# EAGLE design Rauchmelder 3.0 (EAGLE 7.4.0)
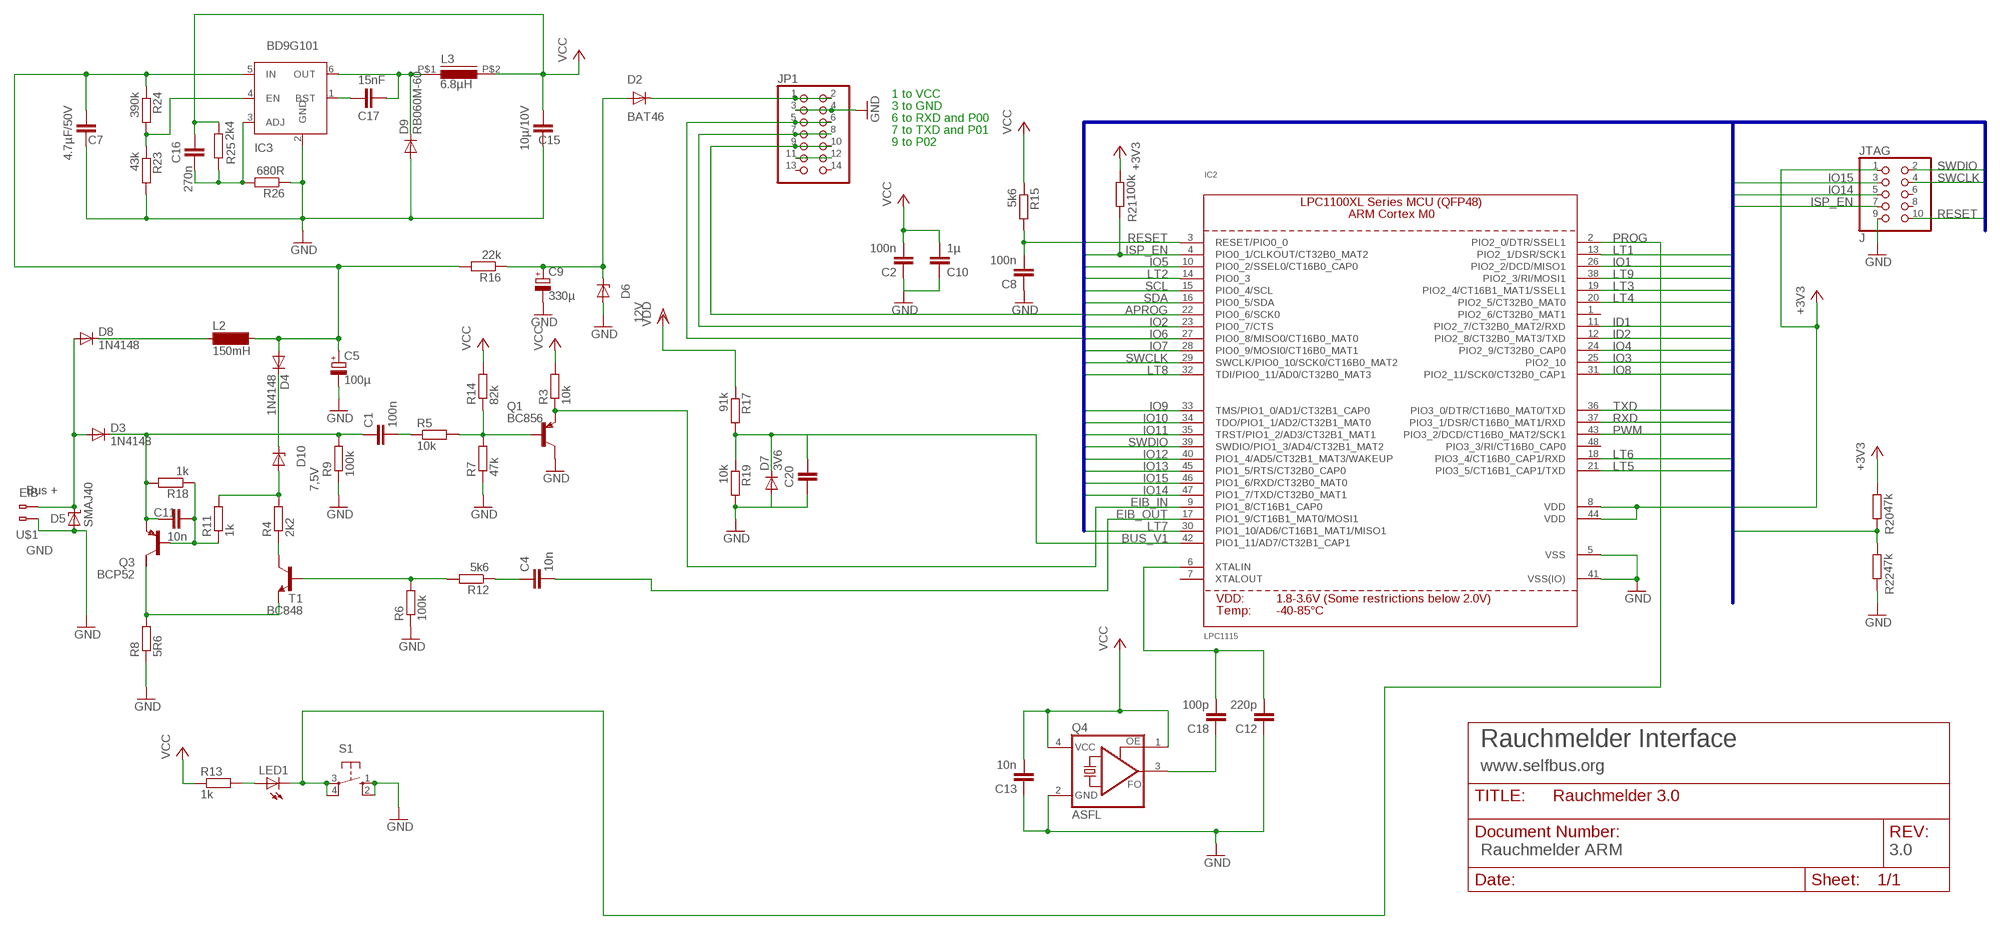
[diagram p0: schematic, sheet 1]

## Parts
C1  100n  C-EUC1206  [C1206]
C2  100n  C-EUC1206  [C1206]
C4  10n  C-EUC1206  [C1206]
C5  100µ  CPOL-EUSANYO_SMD_C6  [SANYO-OSCON_SMD_C6]
C7  4.7µF/50V  C-EUC1206K  [C1206K]
C8  100n  C-EUC1206  [C1206]
C9  330µ  CPOL-EUE3.5-8  [E3,5-8]
C10  1µ  C-EUC1206  [C1206]
C11  10n  C-EUC1206  [C1206]
C12  220p  C-EUC1206  [C1206]
C13  10n  C-EUC1206  [C1206]
C15  10µ/10V  C-EUC1206K  [C1206K]
C16  270n  C-EUC1206  [C1206]
C17  15nF  C-EUC1206  [C1206]
C18  100p  C-EUC1206  [C1206]
C20  C-EUC1206  [C1206]
D2  BAT46  DIODE-MINIMELF  [MINIMELF]
D3  1N4148  DIODE-MINIMELF  [MINIMELF]
D4  1N4148  DIODE-MINIMELF  [MINIMELF]
D5  SMAJ40  SUPPRESSOR-SMBJ  [SMBJ]
D6  12V  ZPD  [MINIMELF]
D7  3V6  DIODE-MINIMELF  [MINIMELF]
D8  1N4148  DIODE-MINIMELF  [MINIMELF]
D9  RB060M-60  DIODE-SOD123  [SOD123]
D10  7,5V  ZPD  [MINIMELF]
IC2  LPC1115  LPC1113/4/5_QFP48_XLSERIES  [LQFP48]
IC3  BD9G101  BD9G101GBD9G101G-SOT23-6  [SOT23-6]
JP1  PINHD-2X7  [2X07]
JTAG  J  PINHD-2X05_2.00  [2X05M]
L2  150mH  BS11  [BS11]
L3  6.8µH  IND_FASTRON_1616FPS  [PIS2812]
LED1  LED3MM  [LED3MM]
Q1  BC856  BC856ALT1SMD  [SOT23-BEC]
Q3  BCP52  FZT753SMD  [SOT223]
Q4  ASFL  [ASF]
R3  10k  R-EU_R1206  [R1206]
R4  2k2  R-EU_R1206  [R1206]
R5  10k  R-EU_R1206  [R1206]
R6  100k  R-EU_R1206  [R1206]
R7  47k  R-EU_R1206  [R1206]
R8  5R6  R-EU_R1206  [R1206]
R9  100k  R-EU_R1206  [R1206]
R11  1k  R-EU_R1206  [R1206]
R12  5k6  R-EU_R1206  [R1206]
R13  1k  R-EU_R1206  [R1206]
R14  82k  R-EU_R1206  [R1206]
R15  5k6  R-EU_R1206  [R1206]
R16  22k  R-EU_R1206  [R1206]
R17  91k  R-EU_R1206  [R1206]
R18  1k  R-EU_R1206  [R1206]
R19  10k  R-EU_R1206  [R1206]
R20  47k  R-EU_R1206  [R1206]
R21  100k  R-EU_R1206  [R1206]
R22  47k  R-EU_R1206  [R1206]
R23  43k  R-EU_R1206  [R1206]
R24  390k  R-EU_R1206  [R1206]
R25  2k4  R-EU_R1206  [R1206]
R26  680R  R-EU_R1206  [R1206]
S1  10-XX  [B3F-10XX]
T1  BC848  [SOT23]
U$1  EIB  [BUSKLEMME243-724]

## Nets
ADJ: C16.1 IC3.3(ADJ) R25.1 R26.2
APROG: IC2.22(PIO0_6/SCK0)
BUS_V1: C20.2 D7.C IC2.42(PIO1_11/AD7/CT32B1_CAP1) R17.2 R19.1
EIB+: D3.A D5.C D8.A U$1.2(B-2)
EIB_DC: C5.+ C7.2 D4.A IC3.5(IN) L2.2 R16.2 R17.1 R24.1 ; supply symbol labelled VDD
EIB_IN: IC2.9(PIO1_8/CT16B1_CAP0) Q1.E R3.1
EIB_OUT: C4.2 IC2.17(PIO1_9/CT16B1_MAT0/MOSI1)
ENABLE_SW: IC3.4(EN) R23.1 R24.2
GND: C2.1 C5.- C7.1 C8.1 C9.- C10.1 C12.1 C13.1 C15.1 C20.1 D5.A D6.A D7.A D9.A IC2.5(VSS) IC2.41(VSS(IO)) IC3.2(GND) JP1.3 JP1.4 JTAG.9 Q1.C Q4.2(GND) R6.1 R7.1 R8.1 R9.1 R19.2 R22.1 R23.2 R26.1 S1.1(S) S1.2(S1) U$1.1(B-1)
ID1: IC2.11(PIO2_7/CT32B0_MAT2/RXD)
ID2: IC2.12(PIO2_8/CT32B0_MAT3/TXD)
IO1: IC2.26(PIO2_2/DCD/MISO1)
IO2: IC2.23(PIO0_7/CTS)
IO3: IC2.25(PIO2_10)
IO4: IC2.24(PIO2_9/CT32B0_CAP0)
IO5: IC2.10(PIO0_2/SSEL0/CT16B0_CAP0)
IO6: IC2.27(PIO0_8/MISO0/CT16B0_MAT0)
IO7: IC2.28(PIO0_9/MOSI0/CT16B0_MAT1)
IO8: IC2.31(PIO2_11/SCK0/CT32B0_CAP1)
IO9: IC2.33(TMS/PIO1_0/AD1/CT32B1_CAP0)
IO10: IC2.34(TDO/PIO1_1/AD2/CT32B1_MAT0)
IO11: IC2.35(TRST/PIO1_2/AD3/CT32B1_MAT1)
IO12: IC2.40(PIO1_4/AD5/CT32B1_MAT3/WAKEUP) R20.1 R22.2
IO13: IC2.45(PIO1_5/RTS/CT32B0_CAP0)
IO14: IC2.47(PIO1_7/TXD/CT32B0_MAT1) JTAG.5
IO15: IC2.46(PIO1_6/RXD/CT32B0_MAT0) JTAG.3
ISP_EN: IC2.4(PIO0_1/CLKOUT/CT32B0_MAT2) JTAG.7 R21.1
LT1: IC2.13(PIO2_1/DSR/SCK1)
LT2: IC2.14(PIO0_3)
LT3: IC2.19(PIO2_4/CT16B1_MAT1/SSEL1)
LT4: IC2.20(PIO2_5/CT32B0_MAT0)
LT5: IC2.21(PIO3_5/CT16B1_CAP1/TXD) JP1.9 JP1.10
LT6: IC2.18(PIO3_4/CT16B0_CAP1/RXD)
LT7: IC2.30(PIO1_10/AD6/CT16B1_MAT1/MISO1)
LT8: IC2.32(TDI/PIO0_11/AD0/CT32B0_MAT3)
LT9: IC2.38(PIO2_3/RI/MOSI1)
LX: C17.1 D9.C IC3.6(OUT) L3.P$1
N$2: Q1.B R5.2 R7.2 R14.1
N$4: C11.2 Q3.1(B) R11.1 R18.1
N$9: LED1.A R13.2
N$10: C9.+ D2.A D6.C R16.1
N$13: D8.C L2.1
N$15: D4.C D10.C
N$16: C1.2 R5.1
N$18: D2.C JP1.1 JP1.2
N$19: C17.2 IC3.1(BST)
N$22: C4.1 R12.1
N$23: R4.1 T1.3(C)
N$24: JP1.11 JP1.12
N$25: D10.A R4.2 R11.2
N$26: Q3.2(C) R8.2 T1.2(E)
N$32: C12.2 C18.2 IC2.6(XTALIN)
N$33: C1.1 C11.1 D3.C Q3.3(E) R9.2 R18.2
N$34: R6.2 R12.2 T1.1(B)
N$35: C18.1 Q4.3(FO)
PROG: IC2.2(PIO2_0/DTR/SSEL1) LED1.K(C) S1.3(P) S1.4(P1)
PWM: IC2.43(PIO3_2/DCD/CT16B0_MAT2/SCK1)
RESET: C8.2 IC2.3(RESET/PIO0_0) JTAG.10 R15.2
RXD: IC2.37(PIO3_1/DSR/CT16B0_MAT1/RXD) JP1.5 JP1.6
SCL: IC2.15(PIO0_4/SCL)
SDA: IC2.16(PIO0_5/SDA)
SWCLK: IC2.29(SWCLK/PIO0_10/SCK0/CT16B0_MAT2) JTAG.4
SWDIO: IC2.39(SWDIO/PIO1_3/AD4/CT32B1_MAT2) JTAG.2
TXD: IC2.36(PIO3_0/DTR/CT16B0_MAT0/TXD) JP1.7 JP1.8
VCC: C2.2 C10.2 C13.2 C15.2 C16.2 IC2.8(VDD) IC2.44(VDD) JTAG.1 L3.P$2 Q4.1(OE) Q4.4(VCC) R3.2 R13.1 R14.2 R15.1 R20.2 R21.2 R25.2 ; supply symbol labelled +3V3
Unconnected: IC2.1(PIO2_6/CT32B0_MAT1) IC2.7(XTALOUT) IC2.48(PIO3_3/RI/CT16B0_CAP0) JP1.13 JP1.14 JTAG.6 JTAG.8 Q3.4(C/)

## Buses
IO[1..15],LT[1..9],SCL,SDA,PWM,APROG,RXD,TXD,RESET,SWCLK,SWDIO,ISP_EN,ID1,ID2

## Notes on the sheet
- 1 to VCC
- 3 to GND
- 6 to RXD and P00
- 7 to TXD and P01
- 9 to P02
- Bus +
- GND
- Rauchmelder Interface
- www.selfbus.org
- Rauchmelder ARM | 3.0

## Library data of the parts
C1 C2 C4 C7 C8 C10-C13 C15-C18 C20 = rcl:C-EU: CAPACITOR, European symbol
C5 C9 = rcl:CPOL-EU: POLARIZED CAPACITOR, European symbol
D2-D4 D7-D9 = diode:DIODE-: DIODE
D5 = diode:SUPPRESSOR-: Suppressor diode
D6 D10 = diode:ZPD: Z DIODE 500 mW
IC2 = microbuilder:LPC1113/4/5_QFP48_XLSERIES: LPC1113/4/5 ARM Cortex M0 MCU (50MHz) - XL Series (FBD48/3x3) LPC1115FBD48/303: Max Frequency: 50MHz Flash: 64kB SRAM: 8kB ADC: 10-bit
IC3 = Stefan_selfbus:BD9G101G
JP1 = pinhead:PINHD-2X7: PIN HEADER
JTAG = pinhead-2:PINHD-2X05: PIN HEADER
L2 = inductor-neosid:BS: INDUCTOR nominal inductance, magnetically screened
L3 = Stefan_selfbus:IND_FASTRON_1616FPS
LED1 = led:LED: LED OSRAM: - CHIPLED LG R971, LG N971, LY N971, LG Q971, LY Q971, LO R971, LY R971 LH N974, LH R974 LS Q976, LO Q976, LY Q976 LO Q996 - Hyper CHIPLED LW Q18S LB Q993, LB Q99A, LB R99A - SideLED LS A670, LO A670, LY A670, LG A670, LP A670 LB A673, LV A673, LT A673, LW A673 LH A674 LY A675 LS A676, LA A676, LO A676, LY A676, LW A676 LS A679, LY A679, LG A679 - Hyper Micro SIDELED® LS Y876, LA Y876, LO Y876, LY Y876 LT Y87S - SmartLED LW L88C, LW L88S LB L89C, LB L89S, LG L890 LS L89K, LO L89K, LY L89K LS L896, LA L896, LO L896, LY L896 - TOPLED LS T670, LO T670, LY T670, LG T670, LP T670 LSG T670, LSP T670, LSY T670, LOP T670, LYG T670 LG T671, LOG T671, LSG T671 LB T673, LV T673, LT T673, LW T673 LH T674 LS T676, LA T676, LO T676, LY T676, LB T676, LH T676, LSB T676, LW T676 LB T67C, LV T67C, LT T67C, LS T67K, LO T67K, LY T67K, LW E67C LS E67B, LA E67B, LO E67B, LY E67B, LB E67C, LV E67C, LT E67C LW T67C LS T679, LY T679, LG T679 LS T770, LO T770, LY T770, LG T770, LP T770 LB T773, LV T773, LT T773, LW T773 LH T774 LS E675, LA E675, LY E675, LS T675 LS T776, LA T776, LO T776, LY T776, LB T776 LHGB T686 LT T68C, LB T68C - Hyper Mini TOPLED® LB M676 - Mini TOPLED Santana® LG M470 LS M47K, LO M47K, LY M47K Source: http://www.osram.convergy.de - LUMILED® LXK2-PW12-R00, LXK2-PW12-S00, LXK2-PW14-U00, LXK2-PW14-V00 LXK2-PM12-R00, LXK2-PM12-S00, LXK2-PM14-U00 LXK2-PE12-Q00, LXK2-PE12-R00, LXK2-PE12-S00, LXK2-PE14-T00, LXK2-PE14-U00 LXK2-PB12-K00, LXK2-PB12-L00, LXK2-PB12-M00, LXK2-PB14-N00, LXK2-PB14-P00, LXK2-PB14-Q00 LXK2-PR12-L00, LXK2-PR12-M00, LXK2-PR14-Q00, LXK2-PR14-R00 LXK2-PD12-Q00, LXK2-PD12-R00, LXK2-PD12-S00 LXK2-PH12-R00, LXK2-PH12-S00 LXK2-PL12-P00, LXK2-PL12-Q00, LXK2-PL12-R00 Source: www.luxeon.com
Q1 = transistor-pnp:BC856*: PNP Transistror
Q3 = transistor-pnp:FZT753SMD: PNP Transistor
Q4 = crystal:ASF*: CRYSTAL CLOCK OSCILLATORS 5.0 Vdc or 3.3 Vdc - LOW PROFILE ULTRA MINIATURE CERAMIC SURFACE MOUNT Source: http://www.abracon.com/Oscillators/asf1-L-L1.pdf; MPN: ASFLM1-50.000MHZ-C-T; OC_FARNELL: 1838931; OC_NEWARK: 99M0411
R3-R9 R11-R26 = rcl:R-EU_: RESISTOR, European symbol
S1 = switch-omron:10-XX: OMRON SWITCH
T1 = transistor:BC848: NPN TRANSISTOR
U$1 = con-wago:EIB

## Board
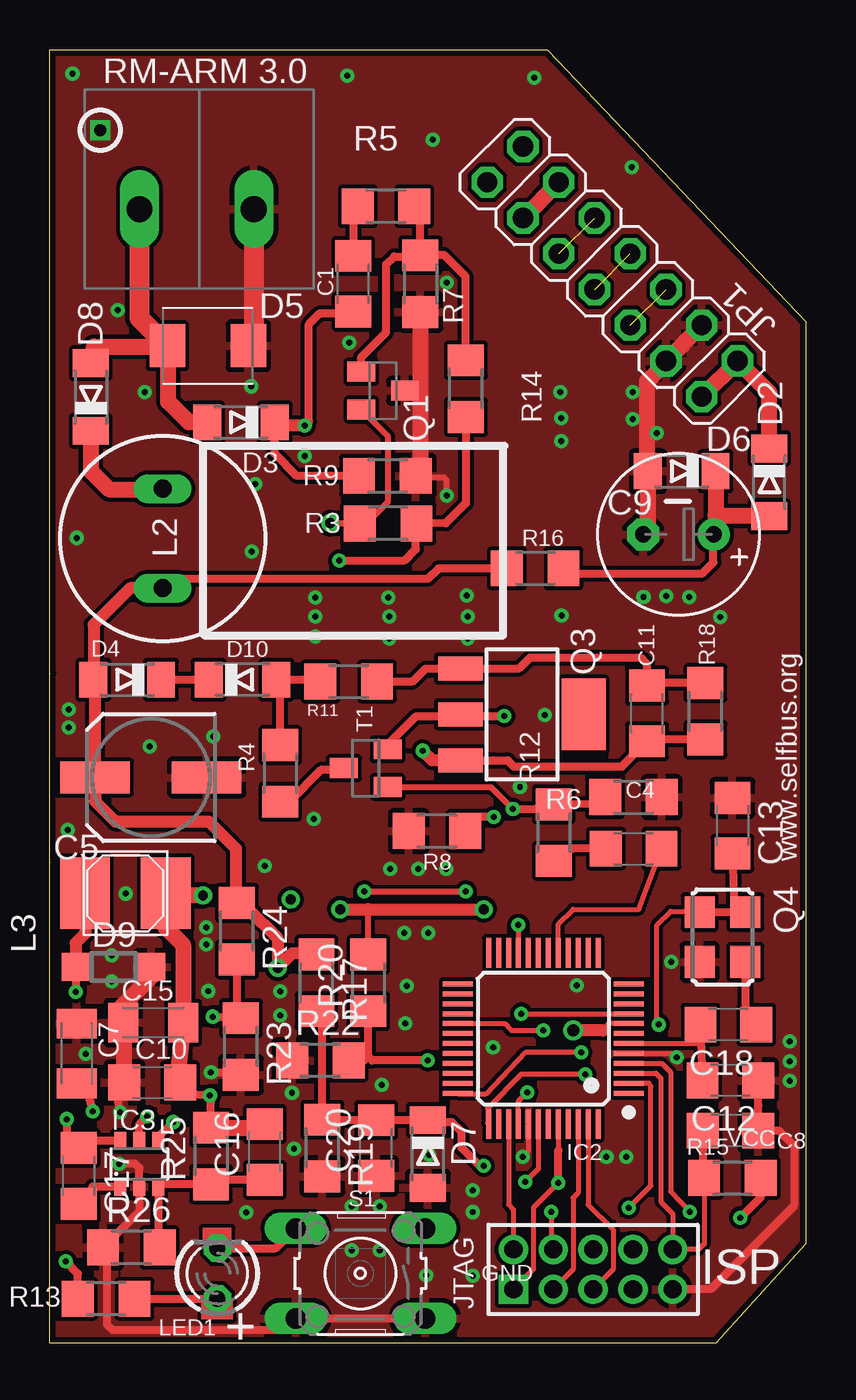
[diagram p1: board, top side]
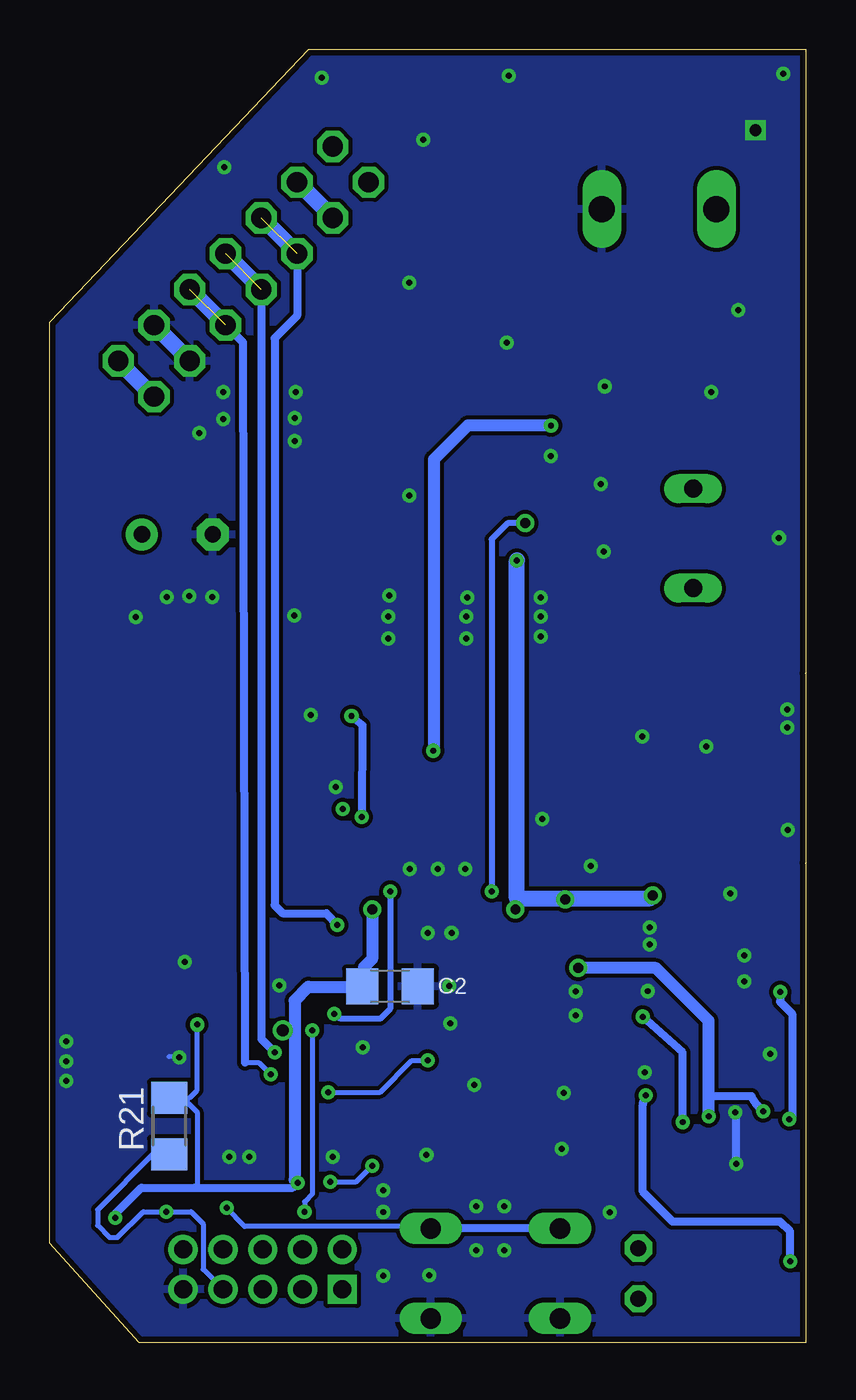
[diagram p2: board, bottom side, seen from below]

Size 38 x 65 mm. Coordinates in mm from the lower left corner, seen from the top.
Outline: 0,33.66 0.04,33.66
Outline: 0.04,24.13 0,24.13
Outline: 0,0 0,65 25,65 38,51.3 38,5 33.5,0 0,0
Copper layers (1*16): Top 0.035mm / dielectric 1.5mm / Bottom 0.035mm
Design rules "default *": minimum track width 10mil, minimum drill 0.3mm, track to track 8mil, track to pad 8mil, pad to pad 8mil, via to via 8mil, smd to smd 8mil, copper to edge 12mil, drill to drill 8mil, minimum pad ring 11mil, minimum via ring 8mil, stop-mask expansion 4mil, vias tented up to drill 0mil, thermal gap 10mil

### Footprints (pad centres in the part's own frame; a part is rotated, then mirrored left to right if it is on the bottom)
C1206 = smd 1.6 x 1.8: 1 -1.4,0; 2 1.4,0
SANYO-OSCON_SMD_C6 = smd 3.5 x 1.6: + 2.8,0; - -2.8,0
C1206K = smd 1.5 x 2: 1 -1.5,0; 2 1.5,0
E3,5-8 = drill 0.813 pad 1.6: + -1.778,0 | drill 0.813 pad 1.6 octagon: - 1.778,0
MINIMELF = smd 1.4 x 1.8: A 1.7,0; C -1.7,0
SMBJ = smd 1.78 x 2.16: A 2.04,0; C -2.03,0
SOD123 = smd 1.4 x 1.4: A 1.9,0; C -1.9,0
LQFP48 = smd 1.5 x 0.25: 1 -4.3,2.75; 2 -4.3,2.25; 3 -4.3,1.75; 4 -4.3,1.25; 5 -4.3,0.75; 6 -4.3,0.25; 7 -4.3,-0.25; 8 -4.3,-0.75; 9 -4.3,-1.25; 10 -4.3,-1.75; 11 -4.3,-2.25; 12 -4.3,-2.75; 25 4.3,-2.75; 26 4.3,-2.25; 27 4.3,-1.75; 28 4.3,-1.25; 29 4.3,-0.75; 30 4.3,-0.25; 31 4.3,0.25; 32 4.3,0.75; 33 4.3,1.25; 34 4.3,1.75; 35 4.3,2.25; 36 4.3,2.75 | smd 0.25 x 1.5: 13 -2.75,-4.3; 14 -2.25,-4.3; 15 -1.75,-4.3; 16 -1.25,-4.3; 17 -0.75,-4.3; 18 -0.25,-4.3; 19 0.25,-4.3; 20 0.75,-4.3; 21 1.25,-4.3; 22 1.75,-4.3; 23 2.25,-4.3; 24 2.75,-4.3; 37 2.75,4.3; 38 2.25,4.3; 39 1.75,4.3; 40 1.25,4.3; 41 0.75,4.3; 42 0.25,4.3; 43 -0.25,4.3; 44 -0.75,4.3; 45 -1.25,4.3; 46 -1.75,4.3; 47 -2.25,4.3; 48 -2.75,4.3
SOT23-6 = smd 0.6 x 0.9: 1 -0.95,-1.15; 2 0,-1.15; 3 0.95,-1.15; 4 0.95,1.15; 5 0,1.15; 6 -0.95,1.15
2X07 = drill 1.016 octagon: 1 -7.62,-1.27; 2 -7.62,1.27; 3 -5.08,-1.27; 4 -5.08,1.27; 5 -2.54,-1.27; 6 -2.54,1.27; 7 0,-1.27; 8 0,1.27; 9 2.54,-1.27; 10 2.54,1.27; 11 5.08,-1.27; 12 5.08,1.27; 13 7.62,-1.27; 14 7.62,1.27
2X05M = drill 0.914 square: 1 -4,-1 | drill 0.914: 2 -4,1; 3 -2,-1; 4 -2,1; 5 0,-1; 6 0,1; 7 2,-1; 8 2,1; 9 4,-1; 10 4,1
BS11 = drill 0.9 long: 1 -2.5,0; 2 2.5,0
PIS2812 = smd 3.6 x 2.5: P$1 0,2.025; P$2 0,-2.025
LED3MM = drill 0.813 octagon: A -1.27,0; K 1.27,0
SOT23-BEC = smd 1 x 1.4: B -0.95,-1.1; C 0,1.1; E 0.95,-1.1
SOT223 = smd 1.219 x 2.235: 1 -2.311,-3.099; 2 0,-3.099; 3 2.311,-3.099 | smd 3.6 x 2.2: 4 0,3.099
ASF = smd 1.6 x 1.5: 1 -1.25,-1.15; 2 1.25,-1.15; 3 1.25,1.15; 4 -1.25,1.15
R1206 = smd 1.6 x 1.803: 1 -1.422,0; 2 1.422,0
B3F-10XX = drill 1.016 long: 1 -3.251,2.261; 2 3.251,2.261; 3 -3.251,-2.261; 4 3.251,-2.261
SOT23 = smd 1 x 1.4: 1 -0.95,-1.1; 2 0.95,-1.1; 3 0,1.1
BUSKLEMME243-724 = drill 1.3 long: 1 -2.875,0; 2 2.875,0

### Placement (x,y rotation side)
C1  15.24,53.24 90 top
C2  20.91,17.93 180 bottom
C4  29.34,24.84 0 top
C5  5.08,28.42 180 top
C7  1.35,14.55 270 top
C8  34.2,10.67 180 top
C9  31.59,40.64 180 top
C10  5.15,13.1 0 top
C11  30.01,31.64 90 top
C12  34.2,13.2 180 top
C13  34.3,26 270 top
C15  5.2,16.1 0 top
C16  10.8,9.6 90 top
C17  1.45,8.4 270 top
C18  34.1,16 180 top
C20  16.4,9.8 90 top
D2  36.15,43.26 270 top
D3  9.6,46.28 180 top
D4  3.89,33.34 180 top
D5  7.94,50.12 0 top
D6  31.75,43.81 180 top
D7  19,9.5 270 top
D8  2.06,47.55 90 top
D9  3.2,18.9 0 top
D10  9.68,33.34 0 top
IC2  24.8,15.3 180 top
IC3  4.5,9 0 top
JP1  28.27,53.85 135 top
JTAG  27.3,3.7 0 top
L2  5.67,40.44 270 top
L3  3.8,22.6 90 top
LED1  8.42,3.49 90 top
Q1  16.75,47.86 270 top
Q3  23.73,31.59 270 top
Q4  33.8,20.4 270 top
R3  17,41.19 0 top
R4  11.58,28.63 90 top
R5  16.89,57.13 0 top
R6  29.33,27.43 180 top
R7  18.62,53.24 90 top
R8  19.46,25.72 0 top
R9  16.96,43.58 180 top
R11  15.02,33.25 180 top
R12  25.32,25.65 90 top
R13  2.84,2.22 0 top
R14  20.91,47.96 270 top
R15  34.29,8.3 180 top
R16  24.39,38.93 180 top
R17  13.4,18.1 270 top
R18  32.94,31.75 270 top
R19  13.7,9.8 270 top
R20  16,18.1 90 top
R21  32,10.9 90 bottom
R22  13.6,14.2 0 top
R23  9.6,14.9 270 top
R24  9.4,20.7 270 top
R25  8.1,9.4 90 top
R26  4.1,4.8 0 top
S1  15.61,3.49 180 top
T1  15.88,28.89 90 top
U$1  7.38,56.99 180 top

### Tracks (layer width: path | path; a pad name or v marks a point on that pad's centre or on a via)
ADJ
  Top 0.406: R26.2 5.45,4.87 IC3.3 5.58,7.98 R25.1 8.32,8.2 C16.1
BUS_V1  (via drill 0.3)
  Top 0.254: IC2.42 24.55,8.75 v23.9,8.1
  Top 0.406: 13.38,16.7 R17.2 13.7,16.38 R19.1 13.72,11.2 C20.2 D7.C 19.1,11.1 20.2,11.1 20.7,10.6 20.7,9.8 21.6,8.9 v21.8,8.9
  Bottom 0.254: v23.9,8.1 22.6,8.1 v21.8,8.9
EIB+
  Top 0.406: D8.A 2.22,49.25 | 5.91,50.09 D5.C 5.95,50.07
  Top 0.813: 2.22,49.25 2.22,50.09 5.91,50.09 | D3.A 6.99,46.28 5.95,47.31 5.95,50.07
  Top 1.016: U$1.2 4.51,51.52 D5.C
EIB_DC  (via drill 0.3, 0.5)
  Top 0.406: R16.2 19.53,38.93 19,38.4 6.14,38.4 L2.2 | D4.A 2.28,33.25 | R24.1 9.98,21.82 | 13.32,19.6 R17.1 | IC3.5 4.5,11 v4.9,11.4 | C7.2 1.75,13.05 v2.15,11.65
  Top 0.61: L2.2 4.04,37.94 2.2,36.1 D4.A | 2.28,33.25 C5.+ 2.28,27.22 3.3,26.2 8,26.2 9.35,24.85 9.35,22.17 R24.1 9.3,21.92 | 9.98,21.82 11.45,20.35 v11.45,18.85 12.2,19.6 13.32,19.6
  Bottom 0.406: v2.15,11.65 2.45,11.95 2.75,12.4 4.8,12.4 4.9,12.5
  Bottom 0.61: v4.9,11.4 4.9,12.5 4.9,16.2 7.55,18.85 v11.45,18.85
EIB_IN  (via drill 0.3, 0.5)
  Top 0.254: v23.7,16.55 IC2.9
  Top 0.305: Q1.E 17,45.56 17,42.3 15.89,41.19 R3.1 v14.11,41.19 v14.1,41.2 | v15.8,22.7 v20.9,22.7
  Bottom 0.305: v14.1,41.2 15,41.2 15.8,40.4 v15.8,22.7 | v20.9,22.7 20.9,16.8 21.4,16.3 23.4,16.3 v23.7,16.55
EIB_OUT
  Top 0.254: IC2.17 25.55,21.05 26.3,21.8 29.6,21.8 C4.2
ENABLE_SW  (via drill 0.3)
  Top 0.406: R24.2 9.4,16.52 9.52,16.4 | IC3.4 5.45,10.35 v6.2,11.1 | v8.2,16.4 9.52,16.4 | 9.52,16.4 R23.1
  Bottom 0.406: v6.2,11.1 6.2,14.6 v8.2,16.4
GND  (via drill 0.3, 0.6)
  Top 0.254: IC2.5 31.25,14.55 v31.5,14.35 | IC2.41 24.05,9.64 v23.77,9.36
  Top 0.305: v19.94,42.59 19.94,43.36 19.8,43.5 18.46,43.5 R9.1
  Top 0.406: 30,43.86 D6.A | S1.1 S1.2 11.78,0.66 3.14,0.66 2.9,0.9 2.9,4.58 R26.1 4.5,6.62 IC3.2 4.5,8.8 4.3,9 v3.5,9 | 18.62,43.53 18.43,43.53 R9.1 | Q1.C 18.56,47.86 18.62,47.8 | v3.55,11.6 3.3,13 C10.1 | JTAG.9 33.2,2.7 37.4,6.9 37.4,9.9 36.63,10.67 C8.1 C12.1 | v8.1,13.6 9.28,13.6 R23.2
  Top 0.813: D6.A 30.05,40.88 C9.- | 30,43.86 30,48.33 30.96,49.28 JP1.4 JP1.3 | R7.1 18.62,47.8 18.62,43.53 | D9.A 5.1,18.4 3.5,16.8 3.5,16.2 C15.1 C10.1
  Top 1.016: U$1.1 10.26,50.39 D5.A
  Bottom 0.254: v31.5,14.35 32,14.4
  Bottom 0.406: v3.5,9 3.5,11.4 v3.55,11.6
  other vias: 10.32,43.18 10.16,39.77 3.41,51.91 4.76,47.78 25.69,45.34 0.95,31.84 5.02,29.98 18.93,3.41 21.25,7.68 17.93,17.95 19.91,23.82 13.34,36.51 17.07,36.51 21,36.51 25.71,36.56 33.68,36.49 10.12,48.08 8.22,30.48 10.81,23.98 24.34,63.59 29.24,59.09 14.94,63.69 19.24,60.49 1.14,63.79 1.36,40.47 37.17,13.16 11.57,16.46 15.04,50.29 12.82,44.58 19.94,53.29 23.63,27.96 24.88,31.56 13.26,26.34 0.95,30.95 2.54,60.96 31.22,19.16 27.97,9.36 28.97,9.36 3.11,19.48 3.11,18.18 3.81,22.58 0.91,25.78 17.81,20.62 18.51,23.82 17.11,23.82 19.01,20.62 22.27,14.86 26.47,17.96 15.17,6.86 16.57,6.86 11.57,17.66 17.87,16.06 21.25,3.38 21.25,6.58 16.67,12.96 37.17,14.16 37.17,15.16 19.07,9.46 12.27,9.76 12.17,12.56 9.87,6.56 15.17,4.66 16.57,4.66 13.34,35.51 13.34,37.46 17.07,35.41 17.02,37.46 20.95,37.56 21,35.41 25.69,46.49 25.64,47.79 29.29,47.79 29.29,46.44 30.49,45.74 30.98,37.54 32.13,37.49 29.83,37.49 7.86,20.88 7.86,20.03 7.96,17.68 1.81,14.53
  pour Top: -1,-0.8 -1.2,66.1 -0.7,66.6 25.9,66.6 39.9,52.6 39.9,2.7 36.6,-0.6
  pour Bottom: -0.7,66.7 26.3,66.7 40.4,52.6 40.4,3.1 35.9,-1.4 -0.5,-1.4 -1.1,-0.5
IO12  (via drill 0.3)
  Top 0.254: IC2.40 23.55,12.15 v24,12.6
  Top 0.406: 16,14.4 R20.1 | 16,14.4 15.8,14.2 R22.2 | v19,14.2 16.2,14.2 16,14.4
  Bottom 0.254: v24,12.6 21.4,12.6 19.8,14.2 v19,14.2
IO14
  Top 0.254: IC2.47 27.05,6.95 28.3,5.7 28.3,3.7 JTAG.5
IO15
  Top 0.254: IC2.46 26.55,7.55 26.3,7.3 26.3,3.7 JTAG.3
ISP_EN  (via drill 0.3)
  Top 0.254: IC2.4 30.75,14.05 31.2,13.6 31.2,7.6 v32.15,6.6
  Bottom 0.254: JTAG.7 30.3,3.7 30.3,6 30.9,6.6 v32.15,6.6 33.3,6.6 34.6,5.3 35,5.3 35.6,5.9 35.6,6.7 32.82,9.48 R21.1
LT5  (via drill 0.3)  (1 unrouted)
  Top 0.254: v23.55,21 IC2.21
  Bottom 0.406: JP1.10 25.58,51.62 26.7,50.5 26.7,22 26.3,21.6 24.1,21.6 v23.55,21
LX  (via drill 0.3)
  Top 0.406: IC3.6 1.95,10.15 C17.1 0.85,10.4 v0.85,11.25 | D9.C v1.3,17.65
  Top 0.61: L3.P$1 1.78,20.57 1.3,20.1 D9.C
  Bottom 0.406: v1.3,17.65 1.3,17.15 0.7,16.55 0.7,11.3 v0.85,11.25
N$2
  Top 0.406: Q1.B 15.65,49.54 16.91,50.8 16.91,54.21 17.3,54.61 17.86,54.61 18.27,55.02 R7.2 | R7.2 18.62,57.07 R5.2 | R14.1 20.9,53.6 19.81,54.69 18.64,54.69 R7.2
N$4
  Top 0.406: R18.1 30.14,33.17 C11.2 30,34.13 29.69,34.45 24.13,34.45 23.58,33.9 Q3.1 18.89,33.89 18.24,33.25 R11.1
N$9
  Top 0.406: R13.2 LED1.A
N$10
  Top 0.406: 33.45,40.72 C9.+ 33.34,40.61 33.34,39.23 32.78,38.67 25.88,38.67 25.82,38.93 R16.1 | 33.48,41.56 33.45,41.59
  Top 0.813: D6.C 33.45,41.59 33.45,40.72 | D2.A 33.48,41.56
N$13
  Top 0.406: 2.07,43.95 2.07,43.83
  Top 0.813: D8.C 2.07,43.95 | 2.07,43.83 3,42.9 5.6,42.9 L2.1
N$15
  Top 0.406: D4.C D10.C
N$16
  Top 0.406: R5.1 15.24,57.57 C1.2
N$18
  Top 0.813: D2.C 36.15,47.76 JP1.1 JP1.2
N$19
  Top 0.406: IC3.1 2.15,7.85 C17.2
N$20
  Bottom 0.813: 23.8,56.6 25.6,58.4
N$22
  Top 0.406: C4.1 26.25,24.84 R12.1
N$23
  Top 0.406: R4.1 12.05,27.21 13.65,28.81 14.7,28.81 T1.3
N$24
  Top 0.813: JP1.11 JP1.12
N$25
  Top 0.406: R11.2 13.5,33.34 D10.A 11.58,33.14 R4.2
N$26  (via drill 0.3)
  Top 0.406: T1.2 16.98,30.07 18.42,31.51 20.56,31.51 | 20.56,31.51 Q3.2 | 20.56,31.51 22.54,31.51 v22.84,31.51 | v22.32,26.43 21.08,26.43 R8.2
  Bottom 0.406: v22.84,31.51 v22.84,31.52 22.3,31.05 v22.32,26.43
N$27
  Bottom 0.813: 25.6,54.7 25.6,54.8 27.4,56.6
N$28
  Bottom 0.813: 27.4,53 29.2,54.8
N$29
  Bottom 0.813: 29.2,51.2 31,53
N$30
  Bottom 0.813: 30.9,49.3 32.8,51.2
N$31
  Bottom 0.813: 32.7,47.6 32.8,47.6 34.6,49.4
N$32
  Top 0.254: IC2.6 32.75,15.05 C18.2
  Top 0.406: C12.2 C18.2
N$33  (via drill 0.3)
  Top 0.406: 11.35,46.28 D3.C 11.3,44.7 12.42,43.58 R9.2 | C1.1 15.16,51.75 13.57,51.75 13.02,51.2 13.02,46.32 v12.81,46.11 | R18.2 30.1,30.33 C11.1 28.74,28.97 23.32,28.97 23.02,29.28 23,29.29 22.3,29.28 Q3.3
  Top 0.61: v18.73,29.77 19.21,29.29 Q3.3 | v12.81,46.11 11.47,46.11 D3.C
  Bottom 0.61: v12.81,46.11 16.99,46.11 18.7,44.4 18.7,29.8 v18.73,29.77
N$34  (via drill 0.3)
  Top 0.305: T1.1 22.16,27.94 v23.27,26.83
  Top 0.406: R6.2 27.18,27.08 R12.2 24.31,26.83 v23.27,26.83
N$35
  Top 0.406: Q4.3 34.95,15.75 C18.1
PROG  (via drill 0.3)
  Top 0.254: v29.1,6.8 30.2,7.9 30.2,12.9 30.1,13.05 IC2.2
  Top 0.406: LED1.K 11.37,4.76 S1.4
  Bottom 0.254: S1.3 19.2,5.75 19.3,5.85 28.2,5.85 v29.1,6.8
  Bottom 0.406: S1.4 S1.3
RESET
  Top 0.254: IC2.3 30.45,13.55 30.7,13.3 30.7,7.1 31.3,6.5 JTAG.10 32.6,4.7 32.87,4.97 R15.2
  Top 0.406: C8.2 32.8,8.37 R15.2
RXD  (via drill 0.3)  (1 unrouted)
  Top 0.254: v26.9,13.5 23.7,13.5 22,11.8 22,11.05 IC2.37
  Bottom 0.254: 28.2,14.1 27.5,14.1 v26.9,13.5
  Bottom 0.406: JP1.6 29.16,51.16 28.3,50.3 28.2,14.1
SWCLK  (via drill 0.3)
  Top 0.254: IC2.29 22.85,16.05 23.2,15.7 v24.8,15.7 | v25.2,6.6 25.2,4.8 JTAG.4
  Bottom 0.254: v24.8,15.7 24.8,7.5 25.2,7.1 v25.2,6.6
SWDIO
  Top 0.254: IC2.39 23.05,6.95 23.3,6.7 JTAG.2
TXD  (via drill 0.3)  (1 unrouted)
  Top 0.254: v26.7,14.6 23.9,14.6 21.9,12.5 20.55,12.5 IC2.36
  Bottom 0.406: JP1.8 27.37,15.27 v26.7,14.6
VCC  (via drill 0.3, 0.5, 0.6)
  Top 0.254: IC2.44 25.55,9.7 | v25.55,8.05 24.3,6.8 24.3,3.7 JTAG.1 | Q4.1 32.6,21.7 31.2,21.7 30.5,21 30.5,16.2 30.35,16.05 30.6,15.8 v30.6,16 | IC2.8 28.05,16.05 27.8,15.7
  Top 0.305: R20.2 16,21.8
  Top 0.406: R14.2 20.91,42.21 19.9,41.2 R3.2 18.4,41.16 18.4,39.9 17.83,39.33 v14.55,39.33 | R13.1 1.41,3.49 v0.8,4.1 | C10.2 6.8,12.5 v8.05,12.45 8.1,12.1 R25.2 | C13.2 34.4,21.9 Q4.4 Q4.1 | R15.1 35.72,7.32 v34.7,6.3 | v25.55,8.05 25.55,9.7
  Top 0.61: v14.6,21.8 16,21.8 v21.8,21.8 | 27.8,15.7 v26.3,15.7
  Top 0.813: C10.2 6.4,13.3 C15.2 6.7,20 5.83,20.88 L3.P$2 5.93,22.5 v7.7,22.5 | R25.2 10.62,10.82 C16.2
  Bottom 0.254: R21.2 31.32,12.32 | 31.32,12.32 30.6,11.6 30.6,7.9 30.7,7.8 | 31.32,12.32 30.98,12.32 30.6,12.7 v30.6,16
  Bottom 0.406: 14.53,39.34 v14.55,39.33 | v0.8,4.1 0.8,5.6 1.3,6.1 6.7,6.1 8.2,7.6 8.2,12 v8.05,12.45 | 14.53,22.35 14.53,21.77 v14.6,21.8 | v34.7,6.3 34.7,6.5 33.4,7.8 30.7,7.8 25.8,7.8 v25.55,8.05
  Bottom 0.61: 25.7,15.8 25.7,17.2 25,17.9 22.33,17.9 C2.2 22.2,18.03 22.2,18.9 21.8,19.3 v21.8,21.8 | 25.7,15.8 25.7,8.2 v25.55,8.05 | v26.3,15.7 25.7,15.8
  Bottom 0.813: 14.53,39.34 14.53,22.35 12.15,22.35 | 12.15,22.35 7.85,22.35 v7.7,22.5 | 12.15,22.35 v12.1,22.3
(copper drawn outside any net)
  shapes: Top area x2

### Text on the board
tPlace: RM-ARM 3.0 | +
tNames: www.selfbus.org | VCC | ISP | GND
tValues: 16V | 35V | 16V